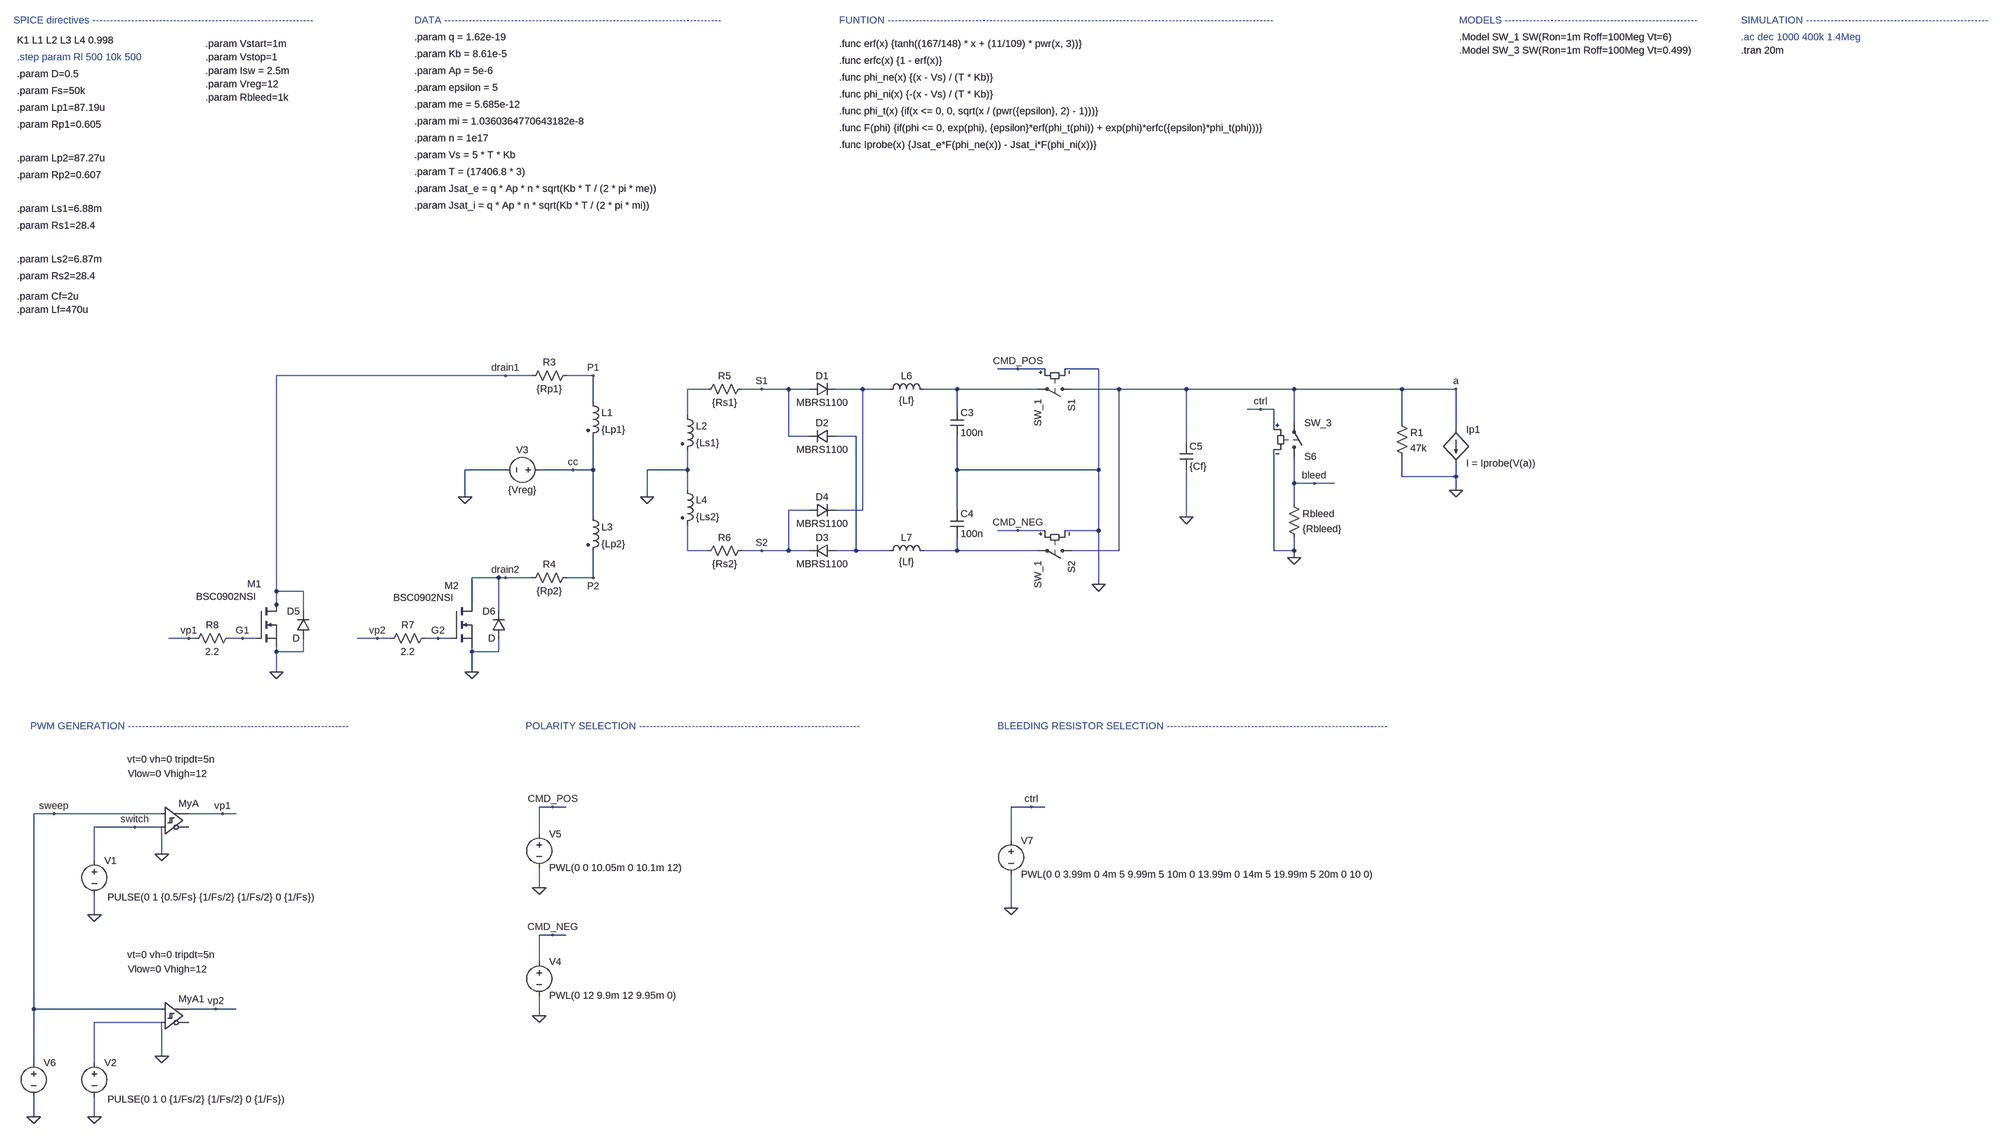
[diagram p0: schematic 6-probe_bps_final.asc]
6-probe_bps_final.asc, the LTspice schematic file:
Version 4.1
SHEET 1 4388 4032
WIRE 1232 592 1184 592
WIRE 1296 592 1232 592
WIRE 1424 592 1344 592
WIRE 16 608 -528 608
WIRE 80 608 16 608
WIRE 224 608 160 608
WIRE 496 640 448 640
WIRE 624 640 576 640
WIRE 688 640 624 640
WIRE 736 640 688 640
WIRE 864 640 800 640
WIRE 928 640 864 640
WIRE 1088 640 1008 640
WIRE 1280 640 1088 640
WIRE 1472 640 1360 640
WIRE 1632 640 1472 640
WIRE 1888 640 1632 640
WIRE 2144 640 1888 640
WIRE 2272 640 2144 640
WIRE 224 672 224 608
WIRE 1088 688 1088 640
WIRE 1808 688 1776 688
WIRE 1840 688 1808 688
WIRE 448 704 448 640
WIRE 1888 720 1888 640
WIRE 2144 720 2144 640
WIRE 1840 736 1840 688
WIRE 2272 736 2272 640
WIRE 688 752 688 640
WIRE 736 752 688 752
WIRE 848 752 800 752
WIRE 1632 768 1632 640
WIRE 16 832 -80 832
WIRE 176 832 96 832
WIRE 224 832 224 752
WIRE 224 832 176 832
WIRE 448 832 448 784
WIRE 448 832 352 832
WIRE 1088 832 1088 752
WIRE 1424 832 1424 592
WIRE 1424 832 1088 832
WIRE 2144 848 2144 800
WIRE 2272 848 2272 816
WIRE 2272 848 2144 848
WIRE 1888 864 1888 800
WIRE 1936 864 1888 864
WIRE 1984 864 1936 864
WIRE 448 880 448 832
WIRE 2272 880 2272 848
WIRE -80 896 -80 832
WIRE 352 896 352 832
WIRE 1888 912 1888 864
WIRE 736 928 688 928
WIRE 864 928 864 640
WIRE 864 928 800 928
WIRE 1088 928 1088 832
WIRE 224 944 224 832
WIRE 1632 944 1632 832
WIRE 1232 976 1184 976
WIRE 1296 976 1232 976
WIRE 1424 976 1424 832
WIRE 1424 976 1344 976
WIRE 448 1024 448 960
WIRE 496 1024 448 1024
WIRE 624 1024 576 1024
WIRE 688 1024 688 928
WIRE 688 1024 624 1024
WIRE 736 1024 688 1024
WIRE 848 1024 848 752
WIRE 848 1024 800 1024
WIRE 928 1024 848 1024
WIRE 1088 1024 1088 992
WIRE 1088 1024 1008 1024
WIRE 1280 1024 1088 1024
WIRE 1472 1024 1472 640
WIRE 1472 1024 1360 1024
WIRE 1840 1024 1840 784
WIRE 1888 1024 1888 992
WIRE 1888 1024 1840 1024
WIRE 1888 1040 1888 1024
WIRE 0 1088 -64 1088
WIRE 16 1088 0 1088
WIRE 80 1088 16 1088
WIRE 224 1088 224 1024
WIRE 224 1088 160 1088
WIRE 1424 1104 1424 976
WIRE -528 1120 -528 608
WIRE -464 1120 -528 1120
WIRE -528 1152 -528 1120
WIRE -64 1152 -64 1088
WIRE -528 1168 -528 1152
WIRE -464 1168 -464 1120
WIRE 0 1168 0 1088
WIRE -736 1232 -784 1232
WIRE -720 1232 -736 1232
WIRE -608 1232 -640 1232
WIRE -576 1232 -608 1232
WIRE -288 1232 -336 1232
WIRE -256 1232 -288 1232
WIRE -144 1232 -176 1232
WIRE -112 1232 -144 1232
WIRE -528 1264 -528 1248
WIRE -464 1264 -464 1232
WIRE -464 1264 -528 1264
WIRE -64 1264 -64 1248
WIRE 0 1264 0 1232
WIRE 0 1264 -64 1264
WIRE -528 1312 -528 1264
WIRE -64 1312 -64 1264
WIRE 128 2016 96 2016
WIRE 160 2016 128 2016
WIRE 1264 2016 1216 2016
WIRE 1296 2016 1264 2016
WIRE -1056 2032 -1104 2032
WIRE -800 2032 -1056 2032
WIRE -656 2032 -736 2032
WIRE -624 2032 -656 2032
WIRE -864 2064 -960 2064
WIRE -800 2064 -864 2064
WIRE 96 2080 96 2016
WIRE 1216 2096 1216 2016
WIRE -800 2128 -800 2080
WIRE -960 2144 -960 2064
WIRE 96 2208 96 2160
WIRE 1216 2256 1216 2176
WIRE -960 2272 -960 2224
WIRE 128 2320 96 2320
WIRE 160 2320 128 2320
WIRE 96 2384 96 2320
WIRE -1104 2496 -1104 2032
WIRE -800 2496 -1104 2496
WIRE -672 2496 -736 2496
WIRE -624 2496 -672 2496
WIRE 96 2512 96 2464
WIRE -800 2528 -960 2528
WIRE -800 2608 -800 2544
WIRE -1104 2624 -1104 2496
WIRE -960 2624 -960 2528
WIRE -1104 2752 -1104 2704
WIRE -960 2752 -960 2704
FLAG 224 608 P1
FLAG 224 1088 P2
FLAG -528 1312 0
FLAG -64 1312 0
FLAG -80 896 0
FLAG 16 608 drain1
FLAG 16 1088 drain2
FLAG -608 1232 G1
FLAG -144 1232 G2
FLAG 176 832 cc
FLAG 624 640 S1
FLAG 624 1024 S2
FLAG -960 2272 0
FLAG -800 2128 0
FLAG -1056 2032 sweep
FLAG -864 2064 switch
FLAG -736 1232 vp1
FLAG -288 1232 vp2
FLAG -656 2032 vp1
FLAG -672 2496 vp2
FLAG -800 2608 0
FLAG -960 2752 0
FLAG 2272 880 0
FLAG 96 2208 0
FLAG 128 2016 CMD_POS
FLAG 1424 1104 0
FLAG 1232 592 CMD_POS
FLAG 2272 640 a
FLAG -1104 2752 0
FLAG 1216 2256 0
FLAG 1264 2016 ctrl
FLAG 1808 688 ctrl
FLAG 1888 1040 0
FLAG 96 2512 0
FLAG 128 2320 CMD_NEG
FLAG 1232 976 CMD_NEG
FLAG 352 896 0
FLAG 1632 944 0
FLAG 1936 864 bleed
SYMBOL ind2 208 656 R0
SYMATTR InstName L1
SYMATTR Value {Lp1}
SYMATTR Type ind
SYMBOL ind2 432 688 R0
SYMATTR InstName L2
SYMATTR Value {Ls1}
SYMATTR Type ind
SYMBOL ind2 208 928 R0
SYMATTR InstName L3
SYMATTR Value {Lp2}
SYMATTR Type ind
SYMBOL ind2 432 864 R0
SYMATTR InstName L4
SYMATTR Value {Ls2}
SYMATTR Type ind
SYMBOL diode 736 656 R270
WINDOW 0 32 32 VTop 2
WINDOW 3 0 32 VBottom 2
SYMATTR InstName D1
SYMATTR Value MBRS1100
SYMBOL diode 800 736 R90
WINDOW 0 0 32 VBottom 2
WINDOW 3 32 32 VTop 2
SYMATTR InstName D2
SYMATTR Value MBRS1100
SYMBOL diode 800 1008 R90
WINDOW 0 0 32 VBottom 2
WINDOW 3 32 32 VTop 2
SYMATTR InstName D3
SYMATTR Value MBRS1100
SYMBOL diode 736 944 R270
WINDOW 0 32 32 VTop 2
WINDOW 3 0 32 VBottom 2
SYMATTR InstName D4
SYMATTR Value MBRS1100
SYMBOL res 176 592 R90
WINDOW 0 0 56 VBottom 2
WINDOW 3 32 56 VTop 2
SYMATTR InstName R3
SYMATTR Value {Rp1}
SYMBOL res 176 1072 R90
WINDOW 0 0 56 VBottom 2
WINDOW 3 32 56 VTop 2
SYMATTR InstName R4
SYMATTR Value {Rp2}
SYMBOL res 592 624 R90
WINDOW 0 0 56 VBottom 2
WINDOW 3 32 56 VTop 2
SYMATTR InstName R5
SYMATTR Value {Rs1}
SYMBOL res 592 1008 R90
WINDOW 0 0 56 VBottom 2
WINDOW 3 32 56 VTop 2
SYMATTR InstName R6
SYMATTR Value {Rs2}
SYMBOL voltage -960 2128 R0
WINDOW 3 31 102 Left 2
WINDOW 123 0 0 Left 0
WINDOW 39 24 46 Left 2
SYMATTR Value PULSE(0 1 {0.5/Fs} {1/Fs/2} {1/Fs/2} 0 {1/Fs})
SYMATTR InstName V1
SYMBOL nmos -576 1152 R0
WINDOW 0 -21 -49 Left 2
WINDOW 3 -143 -19 Left 2
SYMATTR InstName M1
SYMATTR Value BSC0902NSI
SYMBOL nmos -112 1152 R0
WINDOW 0 -17 -45 Left 2
WINDOW 3 -138 -17 Left 2
SYMATTR InstName M2
SYMATTR Value BSC0902NSI
SYMBOL res -160 1216 R90
WINDOW 0 0 56 VBottom 2
WINDOW 3 32 56 VTop 2
SYMATTR InstName R7
SYMATTR Value 2.2
SYMBOL res -624 1216 R90
WINDOW 0 0 56 VBottom 2
WINDOW 3 32 56 VTop 2
SYMATTR InstName R8
SYMATTR Value 2.2
SYMBOL diode -448 1232 R180
WINDOW 0 24 64 Left 2
WINDOW 3 24 0 Left 2
SYMATTR InstName D5
SYMBOL diode 16 1232 R180
WINDOW 0 24 64 Left 2
WINDOW 3 24 0 Left 2
SYMATTR InstName D6
SYMBOL Digital\\diffschmitt -800 1984 R0
WINDOW 3 -82 -81 Left 2
WINDOW 123 -80 -47 Left 2
SYMATTR Value vt=0 vh=0 tripdt=5n
SYMATTR Value2 Vlow=0 Vhigh=12
SYMATTR InstName MyA
SYMBOL Digital\\diffschmitt -800 2448 R0
WINDOW 3 -82 -81 Left 2
WINDOW 123 -80 -47 Left 2
SYMATTR Value vt=0 vh=0 tripdt=5n
SYMATTR Value2 Vlow=0 Vhigh=12
SYMATTR InstName MyA1
SYMBOL voltage -960 2608 R0
WINDOW 3 31 102 Left 2
WINDOW 123 0 0 Left 0
WINDOW 39 24 46 Left 2
SYMATTR Value PULSE(0 1 0 {1/Fs/2} {1/Fs/2} 0 {1/Fs})
SYMATTR InstName V2
SYMBOL bi 2272 736 R0
SYMATTR InstName Ip1
SYMATTR Value I = Iprobe(V(a))
SYMBOL voltage 96 2064 R0
WINDOW 123 0 0 Left 0
WINDOW 39 0 0 Left 0
SYMATTR InstName V5
SYMATTR Value PWL(0 0 10.05m 0 10.1m 12)
SYMBOL sw 1376 640 R90
SYMATTR InstName S1
SYMATTR Value SW_1
SYMBOL sw 1376 1024 R90
SYMATTR InstName S2
SYMATTR Value SW_1
SYMBOL voltage -1104 2608 R0
WINDOW 123 0 0 Left 0
WINDOW 39 0 0 Left 0
WINDOW 3 24 96 Invisible 2
SYMATTR Value PWL(0 {Vstart} 3.4m {0.5*Vstop} 4m {Vstart} 10m {Vstart} 13.4m {0.5*Vstop} 14m {Vstart})
SYMATTR InstName V6
SYMBOL sw 1888 816 M180
SYMATTR InstName S6
SYMATTR Value SW_3
SYMBOL res 1872 896 R0
SYMATTR InstName Rbleed
SYMATTR Value {Rbleed}
SYMBOL voltage 96 2368 R0
WINDOW 123 0 0 Left 0
WINDOW 39 0 0 Left 0
SYMATTR InstName V4
SYMATTR Value PWL(0 12 9.9m 12 9.95m 0)
SYMBOL res 2128 704 R0
SYMATTR InstName R1
SYMATTR Value 47k
SYMBOL ind 912 656 R270
WINDOW 0 32 56 VTop 2
WINDOW 3 5 56 VBottom 2
SYMATTR InstName L6
SYMATTR Value {Lf}
SYMBOL ind 912 1040 R270
WINDOW 0 32 56 VTop 2
WINDOW 3 5 56 VBottom 2
SYMATTR InstName L7
SYMATTR Value {Lf}
SYMBOL cap 1072 688 R0
SYMATTR InstName C3
SYMATTR Value 100n
SYMBOL cap 1072 928 R0
SYMATTR InstName C4
SYMATTR Value 100n
SYMBOL voltage 112 832 R90
WINDOW 0 -32 56 VBottom 2
WINDOW 3 32 56 VTop 2
SYMATTR InstName V3
SYMATTR Value {Vreg}
SYMBOL cap 1616 768 R0
SYMATTR InstName C5
SYMATTR Value {Cf}
SYMBOL voltage 1216 2080 R0
WINDOW 123 0 0 Left 0
WINDOW 39 0 0 Left 0
SYMATTR InstName V7
SYMATTR Value PWL(0 0 3.99m 0 4m 5 9.99m 5 10m 0 13.99m 0 14m 5 19.99m 5 20m 0 10 0)
TEXT -1152 -480 Left 2 ;SPICE directives ---------------------------------------------------------------
TEXT 3144 -440 Left 2 ;.ac dec 1000 400k 1.4Meg
TEXT 3144 -480 Left 2 ;SIMULATION ----------------------------------------------------
TEXT 3144 -408 Left 2 !.tran 20m
TEXT -1144 -432 Left 2 !K1 L1 L2 L3 L4 0.998
TEXT -1144 -272 Left 2 !.param Lp1=87.19u
TEXT -1144 -232 Left 2 !.param Rp1=0.605
TEXT -1144 -152 Left 2 !.param Lp2=87.27u
TEXT -1144 -112 Left 2 !.param Rp2=0.607
TEXT -1144 -32 Left 2 !.param Ls1=6.88m
TEXT -1144 8 Left 2 !.param Rs1=28.4
TEXT -1144 88 Left 2 !.param Ls2=6.87m
TEXT -1144 128 Left 2 !.param Rs2=28.4
TEXT -1144 -312 Left 2 !.param Fs=50k
TEXT -1144 -352 Left 2 !.param D=0.5
TEXT -1144 -392 Left 2 ;.step param Rl 500 10k 500
TEXT -1144 208 Left 2 !.param Lf=470u
TEXT 808 -224 Left 2 !.func F(phi) {if(phi <= 0, exp(phi), {epsilon}*erf(phi_t(phi)) + exp(phi)*erfc({epsilon}*phi_t(phi)))}
TEXT 808 -424 Left 2 !.func erf(x) {tanh((167/148) * x + (11/109) * pwr(x, 3))}
TEXT 808 -480 Left 2 ;FUNTION --------------------------------------------------------------------------------------------------------------
TEXT 808 -384 Left 2 !.func erfc(x) {1 - erf(x)}
TEXT 808 -264 Left 2 !.func phi_t(x) {if(x <= 0, 0, sqrt(x / (pwr({epsilon}, 2) - 1)))}
TEXT -200 -120 Left 2 !.param T = (17406.8 * 3)
TEXT -200 -160 Left 2 !.param Vs = 5 * T * Kb
TEXT -200 -360 Left 2 !.param Ap = 5e-6
TEXT -200 -320 Left 2 !.param epsilon = 5
TEXT -200 -280 Left 2 !.param me = 5.685e-12
TEXT -200 -240 Left 2 !.param mi = 1.0360364770643182e-8
TEXT -200 -200 Left 2 !.param n = 1e17
TEXT -200 -80 Left 2 !.param Jsat_e = q * Ap * n * sqrt(Kb * T / (2 * pi * me))
TEXT -200 -40 Left 2 !.param Jsat_i = q * Ap * n * sqrt(Kb * T / (2 * pi * mi))
TEXT -200 -480 Left 2 ;DATA -------------------------------------------------------------------------------
TEXT 808 -344 Left 2 !.func phi_ne(x) {(x - Vs) / (T * Kb)}
TEXT -200 -440 Left 2 !.param q = 1.62e-19
TEXT 808 -304 Left 2 !.func phi_ni(x) {-(x - Vs) / (T * Kb)}
TEXT -200 -400 Left 2 !.param Kb = 8.61e-5
TEXT 808 -184 Left 2 !.func Iprobe(x) {Jsat_e*F(phi_ne(x)) - Jsat_i*F(phi_ni(x))}
TEXT -696 -424 Left 2 !.param Vstart=1m
TEXT -696 -392 Left 2 !.param Vstop=1
TEXT 2280 -440 Left 2 !.Model SW_1 SW(Ron=1m Roff=100Meg Vt=6)
TEXT 2280 -408 Left 2 !.Model SW_3 SW(Ron=1m Roff=100Meg Vt=0.499)
TEXT -696 -360 Left 2 !.param Isw = 2.5m
TEXT 2280 -480 Left 2 ;MODELS -------------------------------------------------------
TEXT -1112 1824 Left 2 ;PWM GENERATION ---------------------------------------------------------------
TEXT 64 1824 Left 2 ;POLARITY SELECTION ---------------------------------------------------------------
TEXT 1184 1824 Left 2 ;BLEEDING RESISTOR SELECTION ---------------------------------------------------------------
TEXT -696 -328 Left 2 !.param Vreg=12
TEXT -696 -296 Left 2 !.param Rbleed=1k
TEXT -1144 176 Left 2 !.param Cf=2u

The netlist it stands for:
* 6-probe_bps_final.asc
L1 P1 cc {Lp1}
L2 N001 0 {Ls1}
L3 cc P2 {Lp2}
L4 0 N005 {Ls2}
D1 S1 N002 MBRS1100
D2 N004 S1 MBRS1100
D3 N004 S2 MBRS1100
D4 S2 N002 MBRS1100
R3 P1 drain1 {Rp1}
R4 P2 drain2 {Rp2}
R5 S1 N001 {Rs1}
R6 S2 N005 {Rs2}
V1 switch 0 PULSE(0 1 {0.5/Fs} {1/Fs/2} {1/Fs/2} 0 {1/Fs})
M1 drain1 G1 0 0 BSC0902NSI
M2 drain2 G2 0 0 BSC0902NSI
R7 G2 vp2 2.2
R8 G1 vp1 2.2
D5 0 drain1 D
D6 0 drain2 D
A§MyA sweep switch 0 0 0 0 vp1 0 SCHMITT vt=0 vh=0 tripdt=5n Vlow=0 Vhigh=12
A§MyA1 sweep N007 0 0 0 0 vp2 0 SCHMITT vt=0 vh=0 tripdt=5n Vlow=0 Vhigh=12
V2 N007 0 PULSE(0 1 0 {1/Fs/2} {1/Fs/2} 0 {1/Fs})
B§Ip1 a 0 I = Iprobe(V(a))
V5 CMD_POS 0 PWL(0 0 10.05m 0 10.1m 12)
S1 a N003 CMD_POS 0 SW_1
S2 a N006 CMD_NEG 0 SW_1
V6 sweep 0 PWL(0 {Vstart} 3.4m {0.5*Vstop} 4m {Vstart} 10m {Vstart} 13.4m {0.5*Vstop} 14m {Vstart})
S6 bleed a ctrl 0 SW_3
Rbleed bleed 0 {Rbleed}
V4 CMD_NEG 0 PWL(0 12 9.9m 12 9.95m 0)
R1 a 0 47k
L6 N002 N003 {Lf}
L7 N004 N006 {Lf}
C3 N003 0 100n
C4 0 N006 100n
V3 cc 0 {Vreg}
C5 a 0 {Cf}
V7 ctrl 0 PWL(0 0 3.99m 0 4m 5 9.99m 5 10m 0 13.99m 0 14m 5 19.99m 5 20m 0 10 0)
.model D D
.lib standard.dio
.model NMOS NMOS
.model PMOS PMOS
.lib standard.mos
* SPICE directives ---------------------------------------------------------------
* .ac dec 1000 400k 1.4Meg
* SIMULATION ----------------------------------------------------
.tran 20m
K1 L1 L2 L3 L4 0.998
.param Lp1=87.19u
.param Rp1=0.605
.param Lp2=87.27u
.param Rp2=0.607
.param Ls1=6.88m
.param Rs1=28.4
.param Ls2=6.87m
.param Rs2=28.4
.param Fs=50k
.param D=0.5
* .step param Rl 500 10k 500
.param Lf=470u
.func F(phi) {if(phi <= 0, exp(phi), {epsilon}*erf(phi_t(phi)) + exp(phi)*erfc({epsilon}*phi_t(phi)))}
.func erf(x) {tanh((167/148) * x + (11/109) * pwr(x, 3))}
* FUNTION --------------------------------------------------------------------------------------------------------------
.func erfc(x) {1 - erf(x)}
.func phi_t(x) {if(x <= 0, 0, sqrt(x / (pwr({epsilon}, 2) - 1)))}
.param T = (17406.8 * 3)
.param Vs = 5 * T * Kb
.param Ap = 5e-6
.param epsilon = 5
.param me = 5.685e-12
.param mi = 1.0360364770643182e-8
.param n = 1e17
.param Jsat_e = q * Ap * n * sqrt(Kb * T / (2 * pi * me))
.param Jsat_i = q * Ap * n * sqrt(Kb * T / (2 * pi * mi))
* DATA -------------------------------------------------------------------------------
.func phi_ne(x) {(x - Vs) / (T * Kb)}
.param q = 1.62e-19
.func phi_ni(x) {-(x - Vs) / (T * Kb)}
.param Kb = 8.61e-5
.func Iprobe(x) {Jsat_e*F(phi_ne(x)) - Jsat_i*F(phi_ni(x))}
.param Vstart=1m
.param Vstop=1
.Model SW_1 SW(Ron=1m Roff=100Meg Vt=6)
.Model SW_3 SW(Ron=1m Roff=100Meg Vt=0.499)
.param Isw = 2.5m
* MODELS -------------------------------------------------------
* PWM GENERATION ---------------------------------------------------------------
* POLARITY SELECTION ---------------------------------------------------------------
* BLEEDING RESISTOR SELECTION ---------------------------------------------------------------
.param Vreg=12
.param Rbleed=1k
.param Cf=2u
.backanno
.end